# Altium schematic sheet 21 MXM_PCIe.SchDoc
size 594 x 420 mm
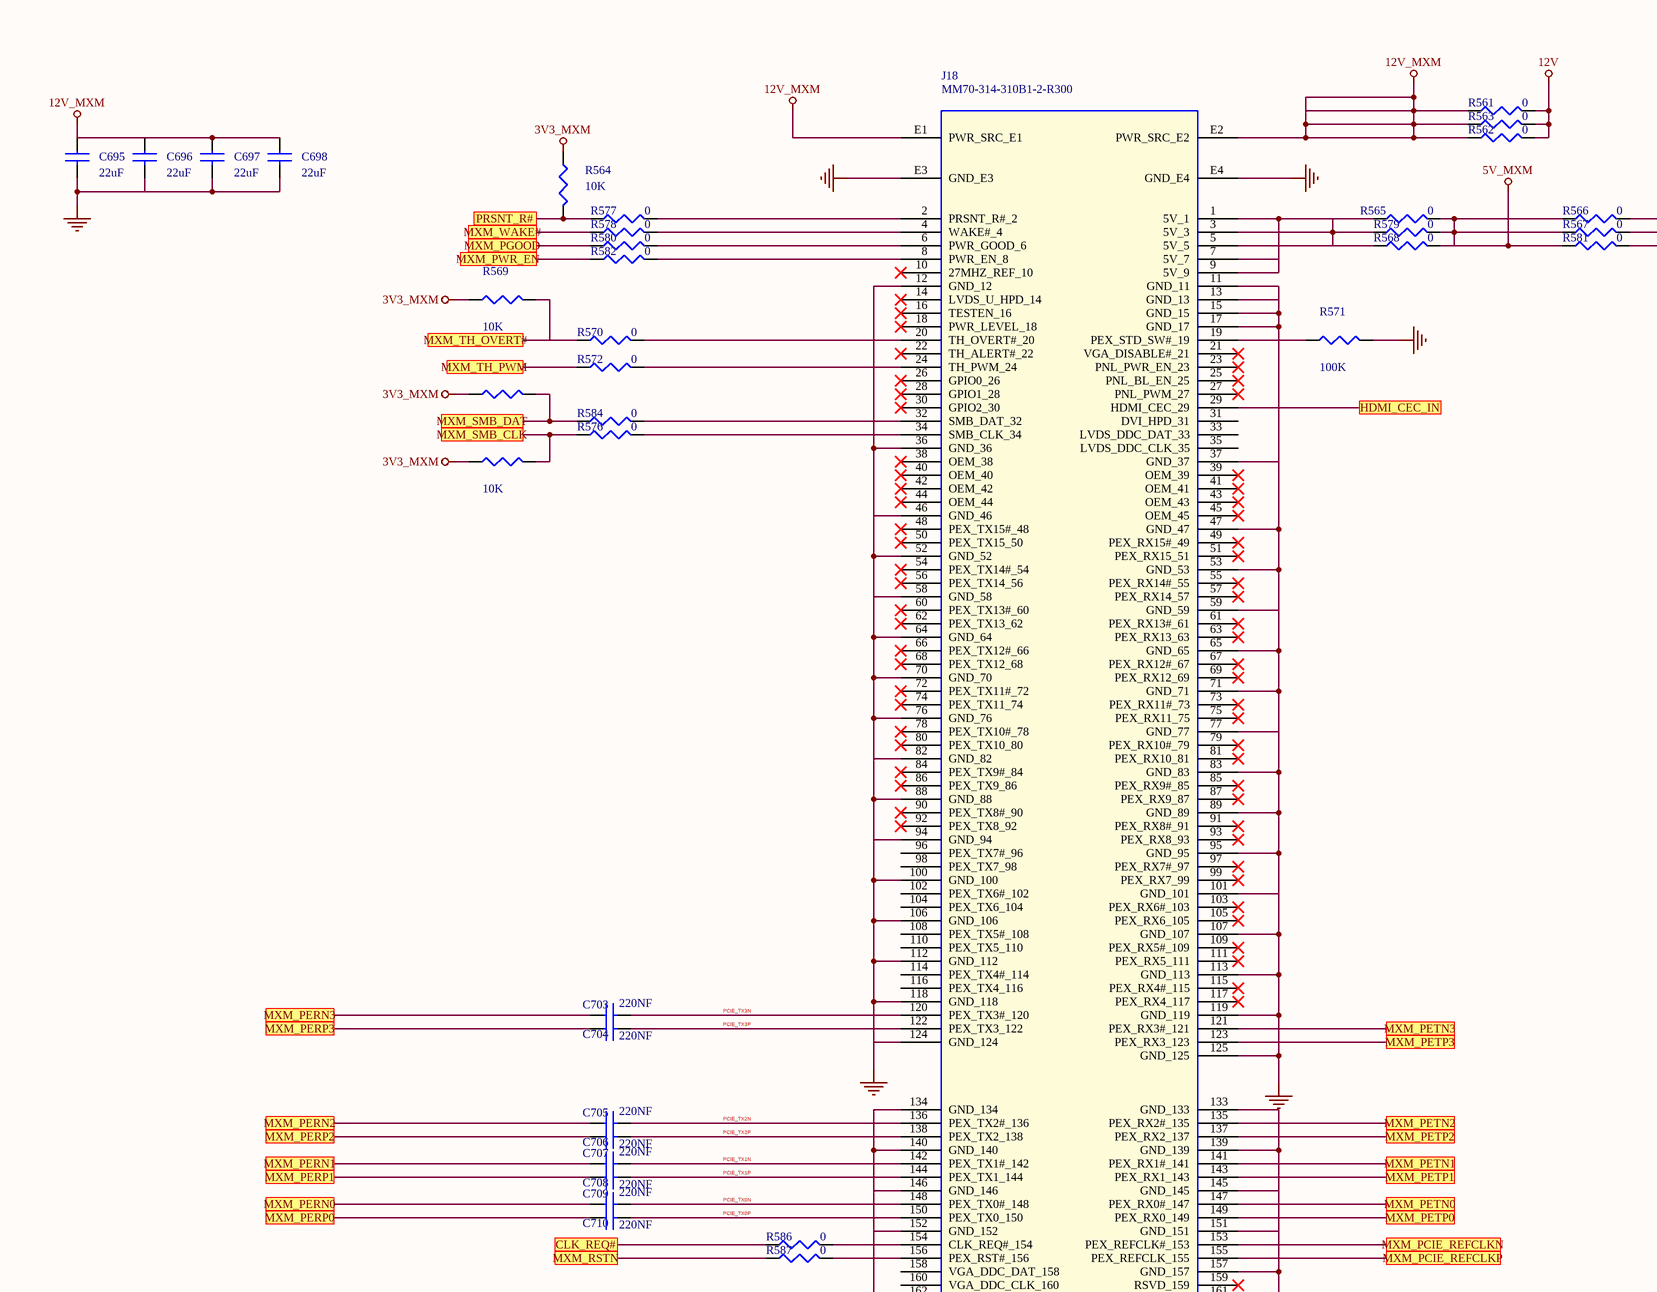
[diagram p0: 21 MXM_PCIe.SchDoc, top left]
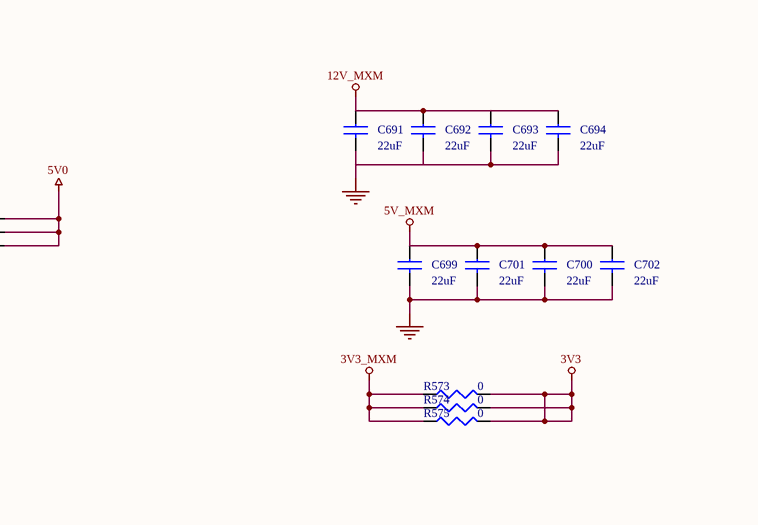
[diagram p1: 21 MXM_PCIe.SchDoc, top right]
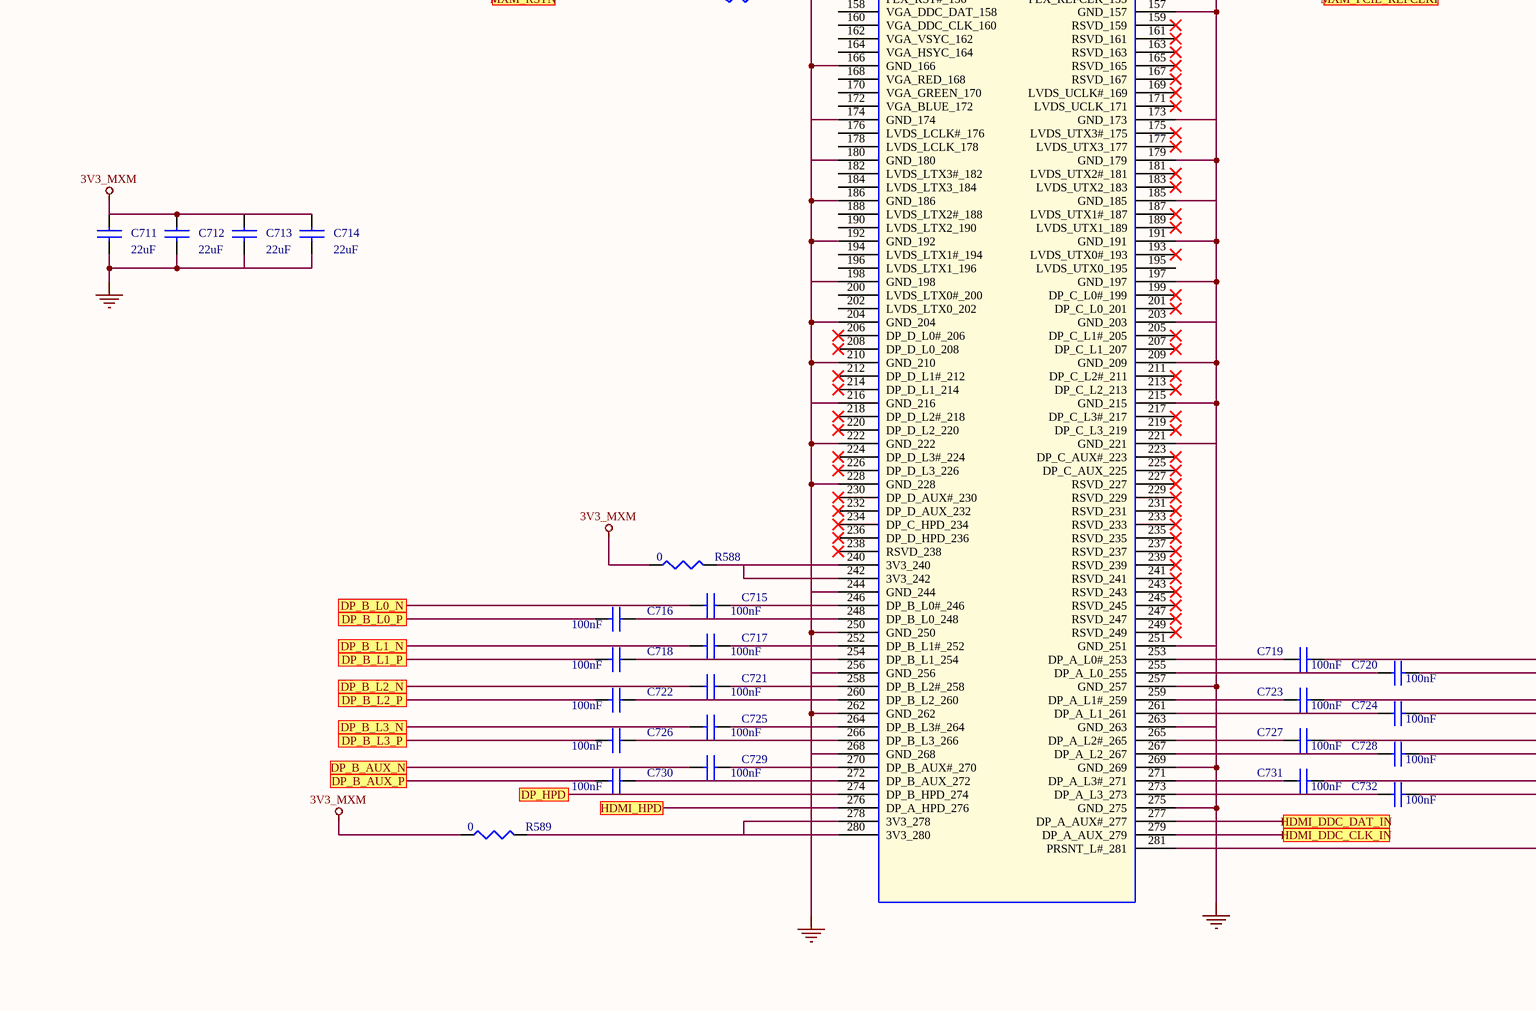
[diagram p2: 21 MXM_PCIe.SchDoc, bottom left]
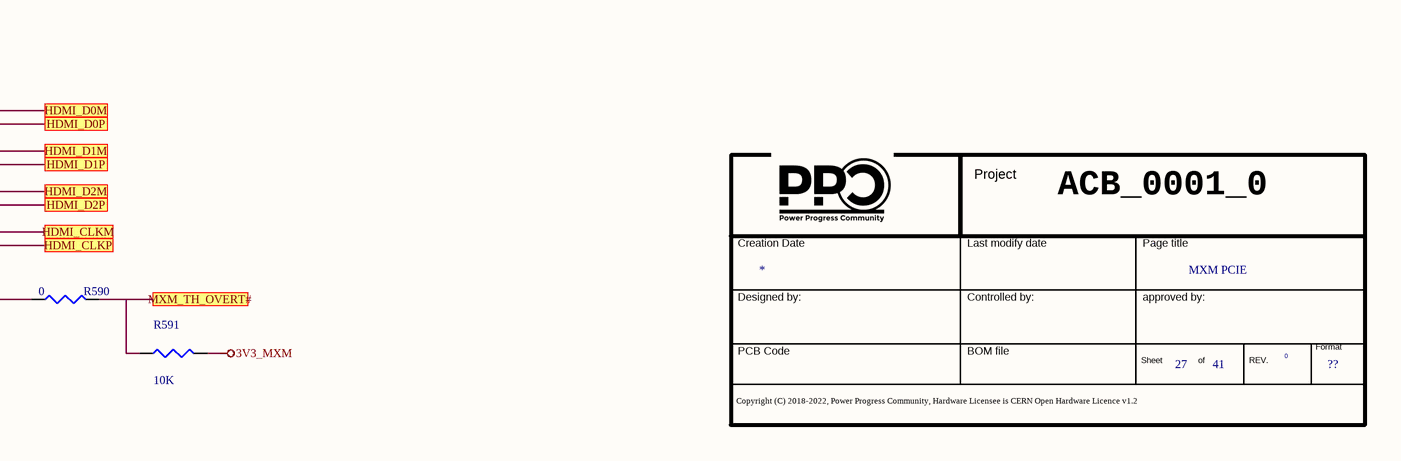
[diagram p3: 21 MXM_PCIe.SchDoc, bottom right]

## Parts
*  Doc: MXM PCIE  Page Count: 41  Page Number: 27  Page Size: ??  RevCode: 0  (hidden comment: Title_block_PPC)  (graphical)
C691  22uF  [SMD_0805]
C692  22uF  [SMD_0805]
C693  22uF  [SMD_0805]
C694  22uF  [SMD_0805]
C695  22uF  [SMD_0805]
C696  22uF  [SMD_0805]
C697  22uF  [SMD_0805]
C698  22uF  [SMD_0805]
C699  22uF  [SMD_0805]
C700  22uF  [SMD_0805]
C701  22uF  [SMD_0805]
C702  22uF  [SMD_0805]
C703  220NF  [SMD_0402]
C704  220NF  [SMD_0402]
C705  220NF  [SMD_0402]
C706  220NF  [SMD_0402]
C707  220NF  [SMD_0402]
C708  220NF  [SMD_0402]
C709  220NF  [SMD_0402]
C710  220NF  [SMD_0402]
C711  22uF  [SMD_0805]
C712  22uF  [SMD_0805]
C713  22uF  [SMD_0805]
C714  22uF  [SMD_0805]
C715  100nF  [SMD_0402]
C716  100nF  [SMD_0402]
C717  100nF  [SMD_0402]
C718  100nF  [SMD_0402]
C719  100nF  [SMD_0402]
C720  100nF  [SMD_0402]
C721  100nF  [SMD_0402]
C722  100nF  [SMD_0402]
C723  100nF  [SMD_0402]
C724  100nF  [SMD_0402]
C725  100nF  [SMD_0402]
C726  100nF  [SMD_0402]
C727  100nF  [SMD_0402]
C728  100nF  [SMD_0402]
C729  100nF  [SMD_0402]
C730  100nF  [SMD_0402]
C731  100nF  [SMD_0402]
C732  100nF  [SMD_0402]
J18  MM70-314-310B1-2-R300  [324 PIN 0.5mm]
R561  0  [SMD_1206]
R562  0  [SMD_1206]
R563  0  [SMD_1206]
R564  10K  [SMD_0402]
R565  0  [SMD_1206]
R566  0  [SMD_1206]
R567  0  [SMD_1206]
R568  0  [SMD_1206]
R569  10K  [SMD_0402]
R570  0  [SMD_0402]
R571  100K  [SMD_0402]
R572  0  [SMD_0402]
R573  0  [SMD_1206]
R574  0  [SMD_1206]
R575  0  [SMD_1206]
R576  0  [SMD_0402]
R577  0  [SMD_0402]
R578  0  [SMD_0402]
R579  0  [SMD_1206]
R580  0  [SMD_0402]
R581  0  [SMD_1206]
R582  0  [SMD_0402]
R583  10K  [SMD_0402]
R584  0  [SMD_0402]
R585  10K  [SMD_0402]
R586  0  [SMD_0402]
R587  0  [SMD_0402]
R588  0  [SMD_1206]
R589  0  [SMD_1206]
R590  0  [SMD_0402]
R591  10K  [SMD_0402]

## Ports
CLK_REQ#, DP_B_AUX_N, DP_B_AUX_P, DP_B_L0_N, DP_B_L0_P, DP_B_L1_N, DP_B_L1_P, DP_B_L2_N, DP_B_L2_P, DP_B_L3_N, DP_B_L3_P, DP_HPD, HDMI_CEC_IN, HDMI_CLKM, HDMI_CLKP, HDMI_D0M, HDMI_D0P, HDMI_D1M, HDMI_D1P, HDMI_D2M, HDMI_D2P, HDMI_DDC_CLK_IN, HDMI_DDC_DAT_IN, HDMI_HPD, MXM_PCIE_REFCLKN, MXM_PCIE_REFCLKP, MXM_PERN0, MXM_PERN1, MXM_PERN2, MXM_PERN3, MXM_PERP0, MXM_PERP1, MXM_PERP2, MXM_PERP3, MXM_PETN0, MXM_PETN1, MXM_PETN2, MXM_PETN3, MXM_PETP0, MXM_PETP1, MXM_PETP2, MXM_PETP3, MXM_PGOOD, MXM_PWR_EN, MXM_RSTN, MXM_SMB_CLK, MXM_SMB_DAT, MXM_TH_OVERT#, MXM_TH_PWM, MXM_WAKE#, PRSNT_R#

## Nets
3V3: R573.2 R574.2 R575.2
3V3_MXM: C711.1 C712.1 C713.1 C714.1 R564.1 R569.1 R573.1 R574.1 R575.1 R583.1 R585.1 R588.2 R589.2 R591.1
5V0: R566.2 R567.2 R581.2
5V_MXM: C699.1 C700.1 C701.1 C702.1 R565.2 R566.1 R567.1 R568.2 R579.2 R581.1
12V: R561.2 R562.2 R563.2
12V_MXM: C691.1 C692.1 C693.1 C694.1 C695.1 C696.1 C697.1 C698.1 J18.E1(PWR_SRC_E1) J18.E2(PWR_SRC_E2) R561.1 R562.1 R563.1
GND: C691.2 C692.2 C693.2 C694.2 C695.2 C696.2 C697.2 C698.2 C699.2 C700.2 C701.2 C702.2 C711.2 C712.2 C713.2 C714.2 J18.11(GND_11) J18.12(GND_12) J18.13(GND_13) J18.15(GND_15) J18.17(GND_17) J18.36(GND_36) J18.37(GND_37) J18.46(GND_46) J18.47(GND_47) J18.52(GND_52) J18.53(GND_53) J18.58(GND_58) J18.59(GND_59) J18.64(GND_64) J18.65(GND_65) J18.70(GND_70) J18.71(GND_71) J18.76(GND_76) J18.77(GND_77) J18.82(GND_82) J18.83(GND_83) J18.88(GND_88) J18.89(GND_89) J18.94(GND_94) J18.95(GND_95) J18.100(GND_100) J18.101(GND_101) J18.106(GND_106) J18.107(GND_107) J18.112(GND_112) J18.113(GND_113) J18.118(GND_118) J18.119(GND_119) J18.124(GND_124) J18.125(GND_125) J18.133(GND_133) J18.134(GND_134) J18.139(GND_139) J18.140(GND_140) J18.145(GND_145) J18.146(GND_146) J18.151(GND_151) J18.152(GND_152) J18.157(GND_157) J18.166(GND_166) J18.173(GND_173) J18.174(GND_174) J18.179(GND_179) J18.180(GND_180) J18.185(GND_185) J18.186(GND_186) J18.191(GND_191) J18.192(GND_192) J18.197(GND_197) J18.198(GND_198) J18.203(GND_203) J18.204(GND_204) J18.209(GND_209) J18.210(GND_210) J18.215(GND_215) J18.216(GND_216) J18.221(GND_221) J18.222(GND_222) J18.228(GND_228) J18.244(GND_244) J18.250(GND_250) J18.251(GND_251) J18.256(GND_256) J18.257(GND_257) J18.262(GND_262) J18.263(GND_263) J18.268(GND_268) J18.269(GND_269) J18.275(GND_275) J18.E3(GND_E3) J18.E4(GND_E4) R571.2
CLK_REQ#: R586.1 ; port CLK_REQ#
DP_B_AUX_N: C729.2 ; port DP_B_AUX_N
DP_B_AUX_P: C730.2 ; port DP_B_AUX_P
DP_B_L0_N: C715.2 ; port DP_B_L0_N
DP_B_L0_P: C716.2 ; port DP_B_L0_P
DP_B_L1_N: C717.2 ; port DP_B_L1_N
DP_B_L1_P: C718.2 ; port DP_B_L1_P
DP_B_L2_N: C721.2 ; port DP_B_L2_N
DP_B_L2_P: C722.2 ; port DP_B_L2_P
DP_B_L3_N: C725.2 ; port DP_B_L3_N
DP_B_L3_P: C726.2 ; port DP_B_L3_P
DP_HPD: J18.274(DP_B_HPD_274) ; port DP_HPD
HDMI_CEC_IN: J18.29(HDMI_CEC_29) ; port HDMI_CEC_IN
HDMI_CLKM: C731.2 ; port HDMI_CLKM
HDMI_CLKP: C732.2 ; port HDMI_CLKP
HDMI_D0M: C719.2 ; port HDMI_D0M
HDMI_D0P: C720.2 ; port HDMI_D0P
HDMI_D1M: C723.2 ; port HDMI_D1M
HDMI_D1P: C724.2 ; port HDMI_D1P
HDMI_D2M: C727.2 ; port HDMI_D2M
HDMI_D2P: C728.2 ; port HDMI_D2P
HDMI_DDC_CLK_IN: J18.279(DP_A_AUX_279) ; port HDMI_DDC_CLK_IN
HDMI_DDC_DAT_IN: J18.277(DP_A_AUX#_277) ; port HDMI_DDC_DAT_IN
HDMI_HPD: J18.276(DP_A_HPD_276) ; port HDMI_HPD
MXM_PCIE_REFCLKN: J18.153(PEX_REFCLK#_153) ; port MXM_PCIE_REFCLKN
MXM_PCIE_REFCLKP: J18.155(PEX_REFCLK_155) ; port MXM_PCIE_REFCLKP
MXM_PERN0: C709.1 ; port MXM_PERN0
MXM_PERN1: C707.1 ; port MXM_PERN1
MXM_PERN2: C705.1 ; port MXM_PERN2
MXM_PERN3: C703.1 ; port MXM_PERN3
MXM_PERP0: C710.1 ; port MXM_PERP0
MXM_PERP1: C708.1 ; port MXM_PERP1
MXM_PERP2: C706.1 ; port MXM_PERP2
MXM_PERP3: C704.1 ; port MXM_PERP3
MXM_PETN0: J18.147(PEX_RX0#_147) ; port MXM_PETN0
MXM_PETN1: J18.141(PEX_RX1#_141) ; port MXM_PETN1
MXM_PETN2: J18.135(PEX_RX2#_135) ; port MXM_PETN2
MXM_PETN3: J18.121(PEX_RX3#_121) ; port MXM_PETN3
MXM_PETP0: J18.149(PEX_RX0_149) ; port MXM_PETP0
MXM_PETP1: J18.143(PEX_RX1_143) ; port MXM_PETP1
MXM_PETP2: J18.137(PEX_RX2_137) ; port MXM_PETP2
MXM_PETP3: J18.123(PEX_RX3_123) ; port MXM_PETP3
MXM_PGOOD: R580.1 ; port MXM_PGOOD
MXM_PWR_EN: R582.1 ; port MXM_PWR_EN
MXM_RSTN: R587.1 ; port MXM_RSTN
MXM_SMB_CLK: R576.1 R585.2 ; port MXM_SMB_CLK
MXM_SMB_DAT: R583.2 R584.1 ; port MXM_SMB_DAT
MXM_TH_OVERT#: R569.2 R570.1 R590.1 R591.2 ; port MXM_TH_OVERT#
MXM_TH_PWM: R572.1 ; port MXM_TH_PWM
MXM_WAKE#: R578.1 ; port MXM_WAKE#
PCIE_TX0N: C709.2 J18.148(PEX_TX0#_148)
PCIE_TX0P: C710.2 J18.150(PEX_TX0_150)
PCIE_TX1N: C707.2 J18.142(PEX_TX1#_142)
PCIE_TX1P: C708.2 J18.144(PEX_TX1_144)
PCIE_TX2N: C705.2 J18.136(PEX_TX2#_136)
PCIE_TX2P: C706.2 J18.138(PEX_TX2_138)
PCIE_TX3N: C703.2 J18.120(PEX_TX3#_120)
PCIE_TX3P: C704.2 J18.122(PEX_TX3_122)
PRSNT_R#: R564.2 R577.1 ; port PRSNT_R#
NetC715_1: C715.1 J18.246(DP_B_L0#_246)
NetC716_1: C716.1 J18.248(DP_B_L0_248)
NetC717_1: C717.1 J18.252(DP_B_L1#_252)
NetC718_1: C718.1 J18.254(DP_B_L1_254)
NetC719_1: C719.1 J18.253(DP_A_L0#_253)
NetC720_1: C720.1 J18.255(DP_A_L0_255)
NetC721_1: C721.1 J18.258(DP_B_L2#_258)
NetC722_1: C722.1 J18.260(DP_B_L2_260)
NetC723_1: C723.1 J18.259(DP_A_L1#_259)
NetC724_1: C724.1 J18.261(DP_A_L1_261)
NetC725_1: C725.1 J18.264(DP_B_L3#_264)
NetC726_1: C726.1 J18.266(DP_B_L3_266)
NetC727_1: C727.1 J18.265(DP_A_L2#_265)
NetC728_1: C728.1 J18.267(DP_A_L2_267)
NetC729_1: C729.1 J18.270(DP_B_AUX#_270)
NetC730_1: C730.1 J18.272(DP_B_AUX_272)
NetC731_1: C731.1 J18.271(DP_A_L3#_271)
NetC732_1: C732.1 J18.273(DP_A_L3_273)
NetJ18_1: J18.1(5V_1) J18.3(5V_3) J18.5(5V_5) J18.7(5V_7) J18.9(5V_9) R565.1 R568.1 R579.1
NetJ18_2: J18.2(PRSNT_R#_2) R577.2
NetJ18_4: J18.4(WAKE#_4) R578.2
NetJ18_6: J18.6(PWR_GOOD_6) R580.2
NetJ18_8: J18.8(PWR_EN_8) R582.2
NetJ18_19: J18.19(PEX_STD_SW#_19) R571.1
NetJ18_20: J18.20(TH_OVERT#_20) R570.2
NetJ18_24: J18.24(TH_PWM_24) R572.2
NetJ18_32: J18.32(SMB_DAT_32) R584.2
NetJ18_34: J18.34(SMB_CLK_34) R576.2
NetJ18_154: J18.154(CLK_REQ#_154) R586.2
NetJ18_156: J18.156(PEX_RST#_156) R587.2
NetJ18_240: J18.240(3V3_240) J18.242(3V3_242) R588.1
NetJ18_278: J18.278(3V3_278) J18.280(3V3_280) R589.1
NetJ18_281: J18.281(PRSNT_L#_281) R590.2

Not connected (* = marked no-connect by the designer): J18 10(27MHZ_REF_10)* 14(LVDS_U_HPD_14)* 16(TESTEN_16)* 18(PWR_LEVEL_18)* 21(VGA_DISABLE#_21)* 22(TH_ALERT#_22)* 23(PNL_PWR_EN_23)* 25(PNL_BL_EN_25)* 26(GPIO0_26)* 27(PNL_PWM_27)* 28(GPIO1_28)* 30(GPIO2_30)* 31(DVI_HPD_31) 33(LVDS_DDC_DAT_33) 35(LVDS_DDC_CLK_35) 38(OEM_38)* 39(OEM_39)* 40(OEM_40)* 41(OEM_41)* 42(OEM_42)* 43(OEM_43)* 44(OEM_44)* 45(OEM_45)* 48(PEX_TX15#_48)* 49(PEX_RX15#_49)* 50(PEX_TX15_50)* 51(PEX_RX15_51)* 54(PEX_TX14#_54)* 55(PEX_RX14#_55)* 56(PEX_TX14_56)* 57(PEX_RX14_57)* 60(PEX_TX13#_60)* 61(PEX_RX13#_61)* 62(PEX_TX13_62)* 63(PEX_RX13_63)* 66(PEX_TX12#_66)* 67(PEX_RX12#_67)* 68(PEX_TX12_68)* 69(PEX_RX12_69)* 72(PEX_TX11#_72)* 73(PEX_RX11#_73)* 74(PEX_TX11_74)* 75(PEX_RX11_75)* 78(PEX_TX10#_78)* 79(PEX_RX10#_79)* 80(PEX_TX10_80)* 81(PEX_RX10_81)* 84(PEX_TX9#_84)* 85(PEX_RX9#_85)* 86(PEX_TX9_86)* 87(PEX_RX9_87)* 90(PEX_TX8#_90)* 91(PEX_RX8#_91)* 92(PEX_TX8_92)* 93(PEX_RX8_93)* 96(PEX_TX7#_96) 97(PEX_RX7#_97)* 98(PEX_TX7_98) 99(PEX_RX7_99)* 102(PEX_TX6#_102) 103(PEX_RX6#_103)* 104(PEX_TX6_104) 105(PEX_RX6_105)* 108(PEX_TX5#_108) 109(PEX_RX5#_109)* 110(PEX_TX5_110) 111(PEX_RX5_111)* 114(PEX_TX4#_114) 115(PEX_RX4#_115)* 116(PEX_TX4_116) 117(PEX_RX4_117)* 158(VGA_DDC_DAT_158) 159(RSVD_159)* 160(VGA_DDC_CLK_160) 161(RSVD_161)* 162(VGA_VSYC_162) 163(RSVD_163)* 164(VGA_HSYC_164) 165(RSVD_165)* 167(RSVD_167)* 168(VGA_RED_168) 169(LVDS_UCLK#_169)* 170(VGA_GREEN_170) 171(LVDS_UCLK_171)* 172(VGA_BLUE_172) 175(LVDS_UTX3#_175)* 176(LVDS_LCLK#_176) 177(LVDS_UTX3_177)* 178(LVDS_LCLK_178) 181(LVDS_UTX2#_181)* 182(LVDS_LTX3#_182) 183(LVDS_UTX2_183)* 184(LVDS_LTX3_184) 187(LVDS_UTX1#_187)* 188(LVDS_LTX2#_188) 189(LVDS_UTX1_189)* 190(LVDS_LTX2_190) 193(LVDS_UTX0#_193)* 194(LVDS_LTX1#_194) 195(LVDS_UTX0_195) 196(LVDS_LTX1_196) 199(DP_C_L0#_199)* 200(LVDS_LTX0#_200) 201(DP_C_L0_201)* 202(LVDS_LTX0_202) 205(DP_C_L1#_205)* 206(DP_D_L0#_206)* 207(DP_C_L1_207)* 208(DP_D_L0_208)* 211(DP_C_L2#_211)* 212(DP_D_L1#_212)* 213(DP_C_L2_213)* 214(DP_D_L1_214)* 217(DP_C_L3#_217)* 218(DP_D_L2#_218)* 219(DP_C_L3_219)* 220(DP_D_L2_220)* 223(DP_C_AUX#_223)* 224(DP_D_L3#_224)* 225(DP_C_AUX_225)* 226(DP_D_L3_226)* 227(RSVD_227)* 229(RSVD_229)* 230(DP_D_AUX#_230)* 231(RSVD_231)* 232(DP_D_AUX_232)* 233(RSVD_233)* 234(DP_C_HPD_234)* 235(RSVD_235)* 236(DP_D_HPD_236)* 237(RSVD_237)* 238(RSVD_238)* 239(RSVD_239)* 241(RSVD_241)* 243(RSVD_243)* 245(RSVD_245)* 247(RSVD_247)* 249(RSVD_249)*

## Notes on the sheet
- ACB_0001_0
- (in symbol Title_block_PPC) Project; Creation Date; Last modify date; Page title; Designed by:; Controlled by:; approved by:; Format; PCB Code; BOM file; Sheet; of; REV.; Copyright (C) 2018-2022, Power Progress Community, Hardware Licensee is CERN Open Hardware Licence v1.2

## Library data of the parts
* = Title_block_PPC: Title: T2080PCIe; Author: MICETEK; Page Create Date: March  8, 1995; Page Title: ?; Page Modify Date: *
C691-C702 C711-C714 = CAP NP_Dup3: 22UF 35V 20% 0805; Part Number: PASSIVE_224; Manufacturer 1: TDK; Manufacturer Part Number 1: C2012X5R1V226M125AC; RSM: RC0805; Part Type: Capacitors\Ceramic\SMD\0805; PCB Footprint: SMD_0805
C703-C710 = CAP NP_Dup10: COND.CER. 220NF 10V 0402 X7R SMD; Manufacturer Part Number 1: GRM155R61A224KE19; Manufacturer 1: Murata; Part Number: PASSIVE_59; RSM: RC0402; Distributor 1: MURATA ELETTRONICA SPA; Part Type: Capacitors\Ceramic\SMD\0402; PCB Footprint: SMD_0402
C715 C717 C721 C725 C729 = CAP NP_Dup3: COND.CER. 100NF 50V 0402 X7R SMD; Manufacturer Part Number 1: CGA2B3X7R1H104M050BD; Manufacturer 1: TDK; Part Number: PASSIVE_24; RSM: RC0402; Distributor 1: DIGKEY (445-9694-2-ND); Part Type: Capacitors\Ceramic\SMD\0402; PCB Footprint: SMD_0402
C716 C718-C720 C722-C724 C726-C728 C730-C732 = CAP NP_Dup3: COND.CER. 100NF 50V 0402 X7R SMD; Part Number: PASSIVE_24; Manufacturer 1: TDK; Manufacturer Part Number 1: CGA2B3X7R1H104M050BD; RSM: RC0402; Part Type: Capacitors\Ceramic\SMD\0402; Distributor 1: DIGKEY (445-9694-2-ND); PCB Footprint: SMD_0402
J18 = CON_MXM_31_2x140: MXM3.0 CARD EDGE CONNECTOR; Manufacturer 1: JAE ELECTRONICS; Part Number: CONNECTORS_626; RSM: PCI-MM70-314-310B1-2-R300; Distributor 1: MOUSER(656-MM70314310B12R); Manufacturer Part Number 1: MM70-314-310B1-2-R300; Part Type: EDGE CONNECTOR; PCB Footprint: 324 PIN 0.5mm
R561-R563 R566-R568 R579 R581 = R_Dup6: RESIS. 0R 1/4W 1206 SMD E96; Manufacturer Part Number 1: CR32000ZL; Manufacturer 1: ASJ; Part Number: PASSIVE_1266; RSM: RC1206; Part Type: Resistors\Fixed\SMD\1206\5%; PCB Footprint: SMD_1206
R564 R569 R583 R585 R591 = R_Dup6: RESIS.CHIP 10K 1% 0402 SMD; Part Number: PASSIVE_584; Manufacturer 1: ROYAL OHM; RSM: RC0402; Part Type: Resistors\Fixed\SMD\0402\1%; PCB Footprint: SMD_0402; Manufacturer Part Number 1: RESIS.CHIP 10K 1% 0402 SMD
R565 R589 = R_Dup9: RESIS. 0R 1/4W 1206 SMD E96; Part Number: PASSIVE_1266; Manufacturer 1: ASJ; Manufacturer Part Number 1: CR32000ZL; RSM: RC1206; Part Type: Resistors\Fixed\SMD\1206\5%; Distributor 1: TTI ITALY SRL; PCB Footprint: SMD_1206
R570 R572 R576 R584 R587 = R_Dup9: RESIS.CHIP 0R 5% 0402 SMD; Part Number: PASSIVE_805; Manufacturer 1: ROYAL OHM; RSM: RC0402; Part Type: Resistors\Fixed\SMD\0402\5%; Manufacturer Part Number 1: RESIS.CHIP 0R 5% 0402 SMD; Distributor 1: CAMEL ELETTRONICA SRL  #; PCB Footprint: SMD_0402
R571 = R_Dup6: RESIS.CHIP 100K 5% 0402 SMD; Part Number: PASSIVE_813; Manufacturer 1: ROYAL OHM; RSM: RC0402; Part Type: Resistors\Fixed\SMD\0402\5%; PCB Footprint: SMD_0402; Manufacturer Part Number 1: RESIS.CHIP 100K 5% 0402 SMD
R573-R575 = R_Dup6: RESIS. 0R 1/4W 1206 SMD E96; Part Number: PASSIVE_1266; Manufacturer 1: ASJ; Manufacturer Part Number 1: CR32000ZL; RSM: RC1206; Part Type: Resistors\Fixed\SMD\1206\5%; PCB Footprint: SMD_1206
R577 R578 R580 R582 R586 R590 = R_Dup9: RESIS.CHIP 0R 5% 0402 SMD; Manufacturer 1: ROYAL OHM; Part Number: PASSIVE_805; RSM: RC0402; Distributor 1: CAMEL ELETTRONICA SRL  #; Manufacturer Part Number 1: RESIS.CHIP 0R 5% 0402 SMD; Part Type: Resistors\Fixed\SMD\0402\5%; PCB Footprint: SMD_0402
R588 = R_Dup9: RESIS. 0R 1/4W 1206 SMD E96; Manufacturer Part Number 1: CR32000ZL; Manufacturer 1: ASJ; Part Number: PASSIVE_1266; RSM: RC1206; Distributor 1: TTI ITALY SRL; Part Type: Resistors\Fixed\SMD\1206\5%; PCB Footprint: SMD_1206